# Altium project STM32F103RB最小系统.PrjPcb
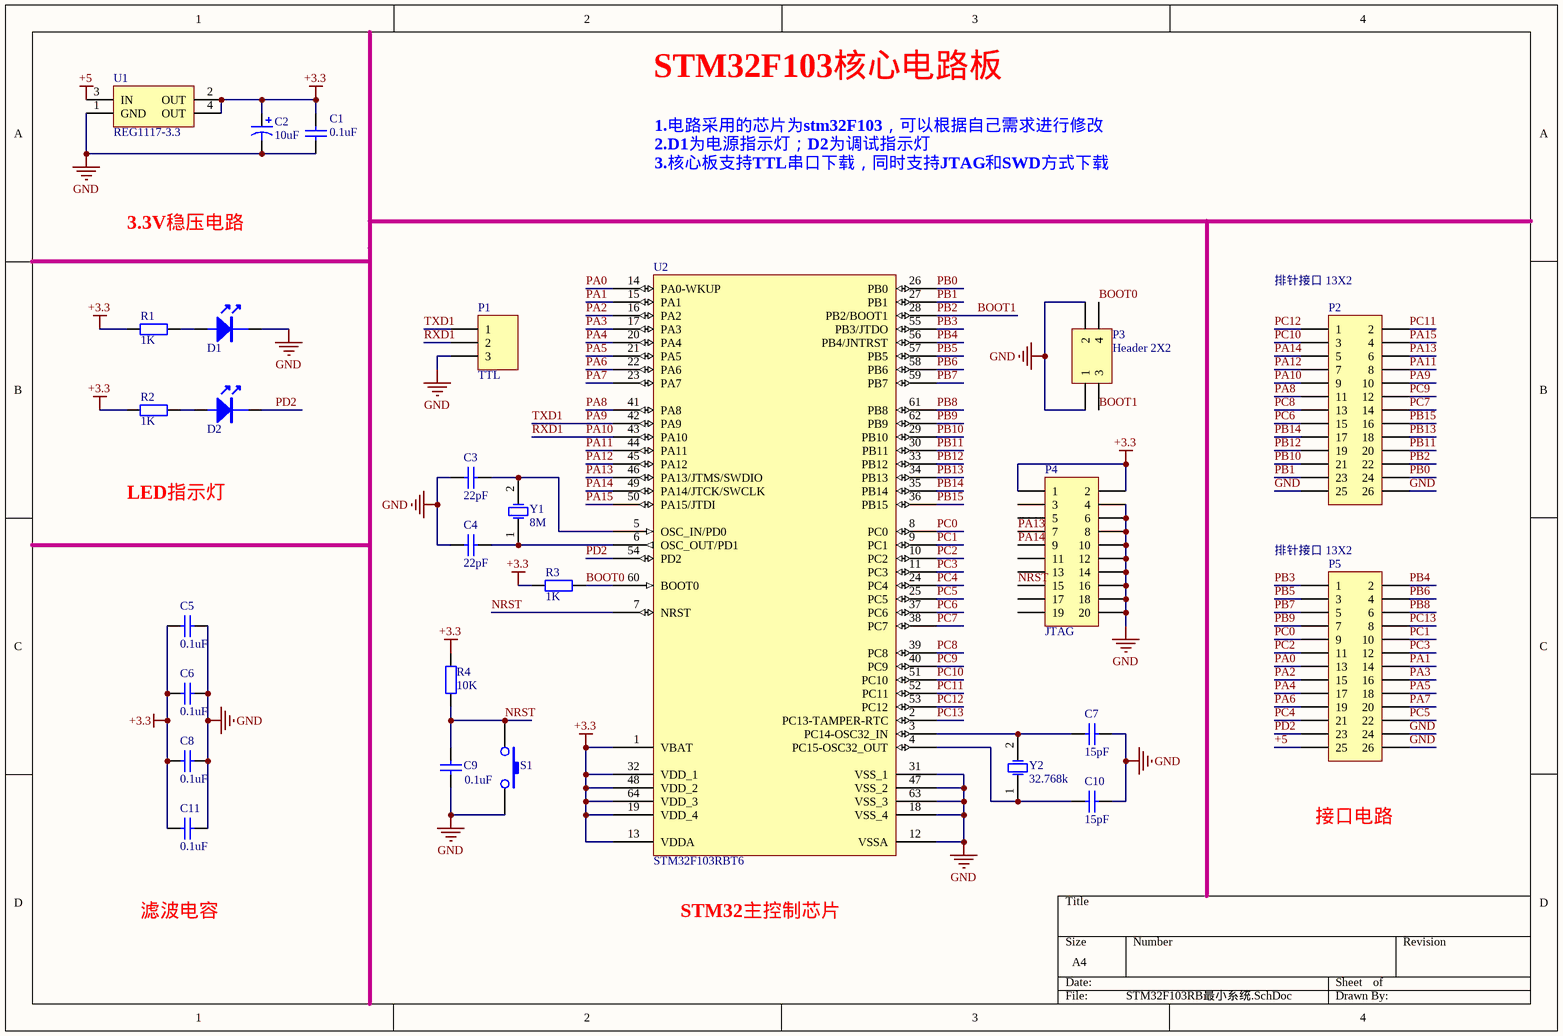
[diagram p0: STM32F103RB最小系统.SchDoc]
1 sheet, 27 parts. Net scope: global (net labels, ports and power ports of the same name join across sheets).
Board file: STM32F103RB最小系统.PcbDoc

## Sheet STM32F103RB最小系统.SchDoc
size A4

### Parts
C1  0.1uF  [0805C]
C2  10uF  [0805C]
C3  22pF  [0805C]
C4  22pF  [0805C]
C5  0.1uF  [0805C]
C6  0.1uF  [0805C]
C7  15pF  [0805C]
C8  0.1uF  [0805C]
C9  0.1uF  [0805C]
C10  15pF  [0805C]
C11  0.1uF  [0805C]
D1  LED  [LED0805]  (value not drawn)
D2  LED  [LED0805]  (value not drawn)
P1  TTL  [HDR1X3]
P2  排针接口 13X2  [HDR2X13]
P3  Header 2X2  [HDR2X2]
P4  JTAG  [JTAG20]
P5  排针接口 13X2  [HDR2X13]
R1  1K  [0805R]
R2  1K  [0805R]
R3  1K  [0805R]
R4  10K  [0805R]
S1  KEY  [KEY_SOP]  (value not drawn)
U1  REG1117-3.3  [ZZ311]
U2  STM32F103RBT6  [LQFP64_N]
Y1  8M  [OSC2PR-1]
Y2  32.768k  [XTAL-B]

### Nets
+3.3: C1.2 C2.1 C5.1 C6.1 C8.1 C11.1 P4.1 P4.2 R1.1 R2.1 R3.1 R4.2 U1.2(OUT) U1.4(OUT) U2.1(VBAT) U2.13(VDDA) U2.19(VDD_4) U2.32(VDD_1) U2.48(VDD_2) U2.64(VDD_3)
+5: P5.25 U1.3(IN)
GND: C1.1 C2.2 C3.1 C4.1 C5.2 C6.2 C7.2 C8.2 C9.1 C10.2 C11.2 D1.2 P1.3 P2.25 P2.26 P3.1 P3.2 P4.4 P4.6 P4.8 P4.10 P4.12 P4.14 P4.16 P4.18 P4.20 P5.24 P5.26 S1.2 U1.1(GND) U2.12(VSSA) U2.18(VSS_4) U2.31(VSS_1) U2.47(VSS_2) U2.63(VSS_3)
BOOT0: P3.4 R3.2 U2.60(BOOT0)
BOOT1: P2.22 P3.3 U2.28(PB2/BOOT1)  [also labelled PB2]
NRST: C9.2 P4.15 R4.1 S1.1 U2.7(NRST)
PA0: P5.13 U2.14(PA0-WKUP)
PA1: P5.14 U2.15(PA1)
PA2: P5.15 U2.16(PA2)
PA3: P5.16 U2.17(PA3)
PA4: P5.17 U2.20(PA4)
PA5: P5.18 U2.21(PA5)
PA6: P5.19 U2.22(PA6)
PA7: P5.20 U2.23(PA7)
PA8: P2.11 U2.41(PA8)
PA9: P1.1 P2.10 U2.42(PA9)  [also labelled TXD1]
PA10: P1.2 P2.9 U2.43(PA10)  [also labelled RXD1]
PA11: P2.8 U2.44(PA11)
PA12: P2.7 U2.45(PA12)
PA13: P2.6 P4.7 U2.46(PA13/JTMS/SWDIO)
PA14: P2.5 P4.9 U2.49(PA14/JTCK/SWCLK)
PA15: P2.4 U2.50(PA15/JTDI)
PB0: P2.24 U2.26(PB0)
PB1: P2.23 U2.27(PB1)
PB3: P5.1 U2.55(PB3/JTDO)
PB4: P5.2 U2.56(PB4/JNTRST)
PB5: P5.3 U2.57(PB5)
PB6: P5.4 U2.58(PB6)
PB7: P5.5 U2.59(PB7)
PB8: P5.6 U2.61(PB8)
PB9: P5.7 U2.62(PB9)
PB10: P2.21 U2.29(PB10)
PB11: P2.20 U2.30(PB11)
PB12: P2.19 U2.33(PB12)
PB13: P2.18 U2.34(PB13)
PB14: P2.17 U2.35(PB14)
PB15: P2.16 U2.36(PB15)
PC0: P5.9 U2.8(PC0)
PC1: P5.10 U2.9(PC1)
PC2: P5.11 U2.10(PC2)
PC3: P5.12 U2.11(PC3)
PC4: P5.21 U2.24(PC4)
PC5: P5.22 U2.25(PC5)
PC6: P2.15 U2.37(PC6)
PC7: P2.14 U2.38(PC7)
PC8: P2.13 U2.39(PC8)
PC9: P2.12 U2.40(PC9)
PC10: P2.3 U2.51(PC10)
PC11: P2.2 U2.52(PC11)
PC12: P2.1 U2.53(PC12)
PC13: P5.8 U2.2(PC13-TAMPER-RTC)
PD2: D2.2 P5.23 U2.54(PD2)
NetC3_2: C3.2 U2.5(OSC_IN/PD0) Y1.2(OSC2)
NetC4_2: C4.2 U2.6(OSC_OUT/PD1) Y1.1(OSC1)
NetC7_1: C7.1 U2.3(PC14-OSC32_IN) Y2.2(OSC2)
NetC10_1: C10.1 U2.4(PC15-OSC32_OUT) Y2.1(OSC1)
NetD1_1: D1.1 R1.2
NetD2_1: D2.1 R2.2

Not connected (* = marked no-connect by the designer): P4 3 5 11 13 17 19

### Notes on the sheet
- STM32F103核心电路板
- 3.3V稳压电路
- 1.电路采用的芯片为stm32F103，可以根据自己需求进行修改
  2.D1为电源指示灯；D2为调试指示灯
  3.核心板支持TTL串口下载，同时支持JTAG和SWD方式下载
- LED指示灯
- 接口电路
- 滤波电容
- STM32主控制芯片

### Library data of the parts
C1 C3-C11 = Cap: Capacitor; Published: 8-Jun-2000; LatestRevisionDate: 17-Jul-2002; LatestRevisionNote: Re-released for DXP Platform.; PackageReference: RAD-0.3; Publisher: Altium Limited
  C1 C5 C6 C8 C9 C11: Value: 0.1uF
  C3 C4: Value: 22pF
  C7 C10: Value: 15pF
C2 = Cap Pol1: Polarized Capacitor (Radial); Published: 8-Jun-2000; LatestRevisionDate: 17-Jul-2002; LatestRevisionNote: Re-released for DXP Platform.; PackageReference: RB7.6-15; Publisher: Altium Limited; Value: 10uF
P1 = Header 3: Header, 3-Pin; LatestRevisionDate: 17-Jul-2002; LatestRevisionNote: Re-released for DXP Platform.; Publisher: Altium Limited
P2 P5 = Header 13X2: Header, 13-Pin, Dual row; LatestRevisionDate: 17-Jul-2002; LatestRevisionNote: Re-released for DXP Platform.; Publisher: Altium Limited
P3 = Header 2X2: Header, 2-Pin, Dual row; LatestRevisionDate: 17-Jul-2002; LatestRevisionNote: Re-released for DXP Platform.; Publisher: Altium Limited
P4 = Header 10X2: Header, 10-Pin, Dual row; LatestRevisionDate: 17-Jul-2002; LatestRevisionNote: Re-released for DXP Platform.; Publisher: Altium Limited
R1-R4 = Res2: Resistor; Published: 8-Jun-2000; LatestRevisionDate: 17-Jul-2002; LatestRevisionNote: Re-released for DXP Platform.; PackageReference: AXIAL-0.4; Publisher: Altium Limited
  R1-R3: Value: 1K
  R4: Value: 10K
U1 = REG1117-3.3: 800mA and 1A Low Dropout Positive Regulator 2.85V, 3.3V, 5V, and Adjustable; Published: 8-Jun-2000; LatestRevisionDate: 17-Jul-2002; LatestRevisionNote: Re-released for DXP Platform.; DatasheetVersion: Sep-1997; PackageVersion: revC; PackageReference: ZZ311; Publisher: Altium Limited; PackageDescription: SOT-223/SC-73; 4 Leads; Body 6.7 x 7.3 mm, inc. leads (LxW max); ComponentLink1Description: Manufacturer Link; ComponentLink1URL: http://www.ti.com/; ComponentLink2Description: Datasheet; ComponentLink2URL: http://www-s.ti.com/sc/ds/REG1117.pdf
U2 = STM32F103RBT6: STM32 ARM-based 32-bit MCU with 128 Kbytes Flash, 64-pin LQFP, Industrial Temperature; Published: 30-May-2008; DatasheetVersion: rev6, Mar-2008; PackageVersion: Mar-2008; PackageReference: LQFP64; Publisher: Altium Limited; PackageDescription: 64-Pin Low-Profile Quad Flat Pack, 10 x 10 mm Body, 0.5 mm Pitch (LQFP64); ComponentLink1Description: Manufacturer Link; ComponentLink1URL: www.st.com/stm32; ComponentLink2Description: Datasheet; ComponentLink2URL: http://www.st.com/stonline/products/literature/ds/13587.pdf
Y1 Y2 = XTAL: Crystal Oscillator; Published: 8-Jun-2000; LatestRevisionDate: 17-Jul-2002; LatestRevisionNote: Re-released for DXP Platform.; PackageReference: R38; Publisher: Altium Limited